# Altium schematic sheet Sheet2.SchDoc
size A3
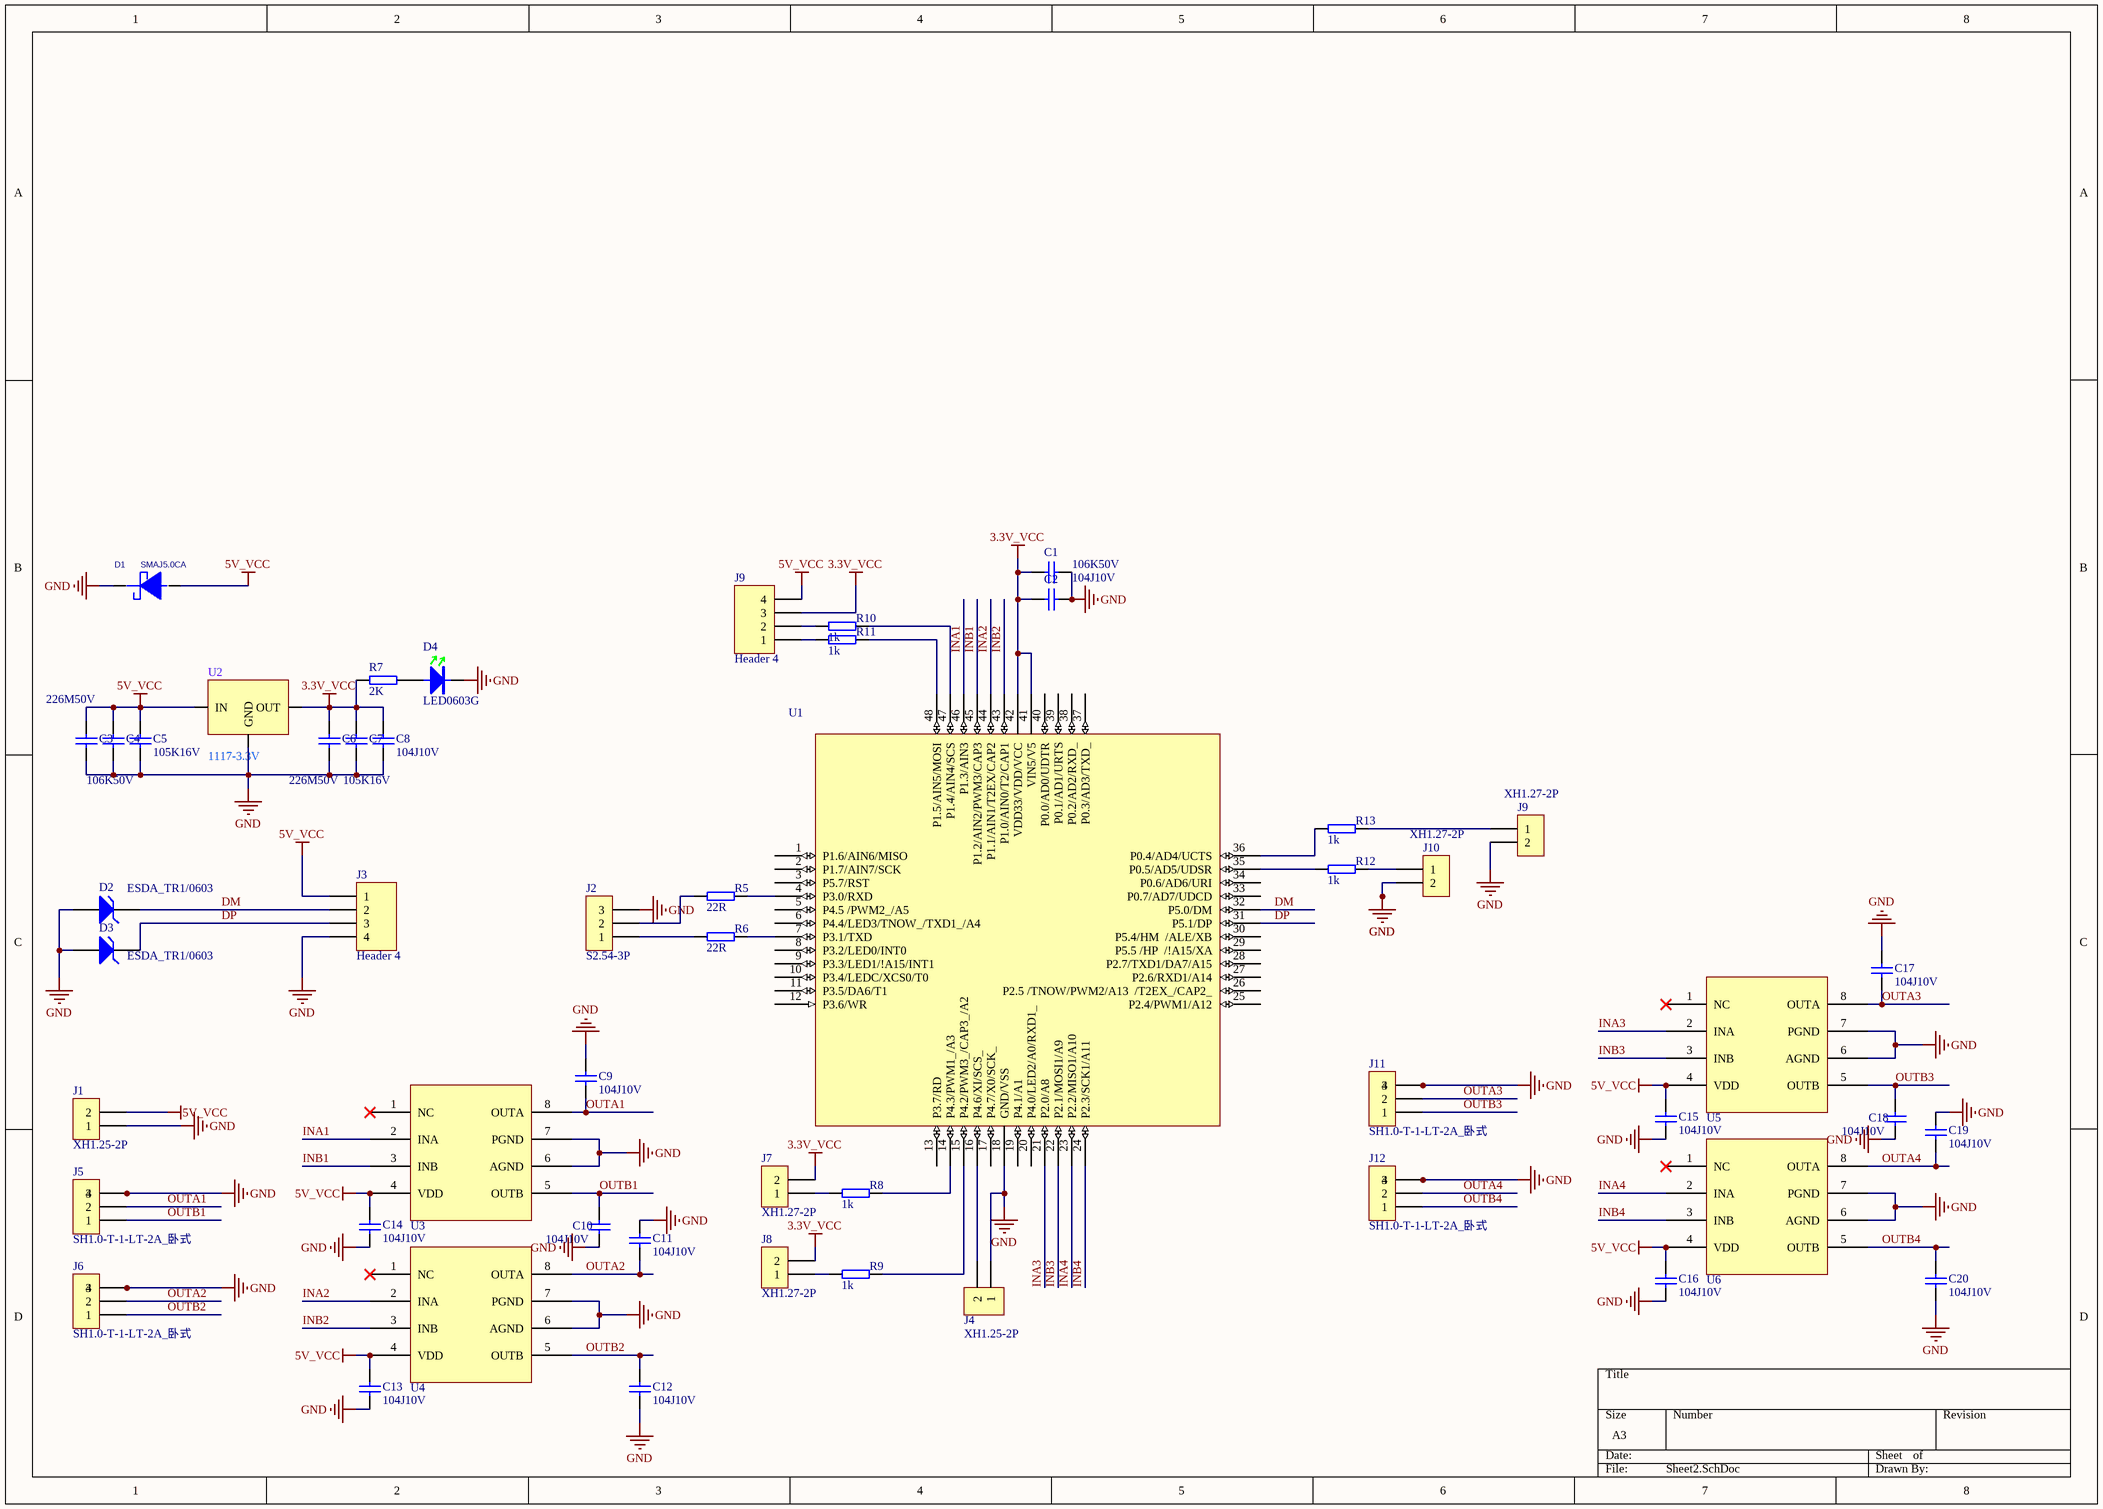
[diagram p0: Sheet2.SchDoc]

## Parts
(Parts that share a designator on the sheet are numbered #1, #2 ... from top to bottom, then left to right.)
C1  106K50V  [C0603]
C2  104J10V  [C0402]
C3  226M50V  [C0805]
C4  106K50V  [C0603]
C5  105K16V  [C0603]
C6  226M50V  [C0805]
C7  105K16V  [C0603]
C8  104J10V  [C0402]
C9  104J10V  [C0402]
C10  104J10V  [C0402]
C11  104J10V  [C0402]
C12  104J10V  [C0402]
C13  104J10V  [C0402]
C14  104J10V  [C0402]
C15  104J10V  [C0402]
C16  104J10V  [C0402]
C17  104J10V  [C0402]
C18  104J10V  [C0402]
C19  104J10V  [C0402]
C20  104J10V  [C0402]
D1  SMAJ5.0CA  [DO-214]
D2  ESDA_TR1/0603  [HS_0603D]
D3  ESDA_TR1/0603  [HS_0603D]
D4  LED0603G  [D-LED0603G]
J1  XH1.25-2P  [XH2.54-2p]
J2  S2.54-3P  [S2.54-3P]
J3  Header 4  [XH2.54-4P]
J4  XH1.25-2P  [S1.25-2P]
J5  SH1.0-T-1-LT-2A_卧式  [J-SH2.0-T-1-LT-2A_立式]
J6  SH1.0-T-1-LT-2A_卧式  [J-SH2.0-T-1-LT-2A_立式]
J7  XH1.27-2P  [J-SH1.27-2]
J8  XH1.27-2P  [J-SH1.27-2]
J9#1  Header 4  [J-SH1.27 -4]
J9#2  XH1.27-2P  [J-SH1.27-2]
J10  XH1.27-2P  [J-SH1.27-2]
J11  SH1.0-T-1-LT-2A_卧式  [J-SH2.0-T-1-LT-2A_立式]
J12  SH1.0-T-1-LT-2A_卧式  [J-SH2.0-T-1-LT-2A_立式]
R5  22R  [R0603]
R6  22R  [R0603]
R7  2K  [R0603]
R8  1k  [R0603]
R9  1k  [R0603]
R10  1k  [R0603]
R11  1k  [R0603]
R12  1k  [R0603]
R13  1k  [R0603]
U1  CH559L  [LQFP48]  (value not drawn)
U2  1117-3.3V  [SOT-223]
U3  PTC918  [SO-8]  (value not drawn)
U4  PTC918  [SO-8]  (value not drawn)
U5  PTC918  [SO-8]  (value not drawn)
U6  PTC918  [SO-8]  (value not drawn)

## Nets
3.3V_VCC: C1.2 C2.2 C6.1 C7.2 C8.1 J7.2 J8.2 J9#1.3 R7.2 U1.41(VIN5/V5) U1.42(VDD33/VDD/VCC) U2.2(OUT)
5V_VCC: C3.1 C4.1 C5.1 C13.1 C14.1 C15.1 C16.1 D1.1(+) J1.2 J3.1 J9#1.4 U2.3(IN) U3.4(VDD) U4.4(VDD) U5.4(VDD) U6.4(VDD)
GND: C1.1 C2.1 C3.2 C4.2 C5.2 C6.2 C7.1 C8.2 C9.1 C10.2 C11.1 C12.2 C13.2 C14.2 C15.2 C16.2 C17.1 C18.2 C19.1 C20.2 D1.2(-) D2.1(A) D3.1(A) D4.2 J1.1 J2.3 J3.4 J4.1 J5.3 J5.4 J6.3 J6.4 J9#2.2 J10.2 J11.3 J11.4 J12.3 J12.4 U1.18(GND/VSS) U2.1(GND) U3.6(AGND) U3.7(PGND) U4.6(AGND) U4.7(PGND) U5.6(AGND) U5.7(PGND) U6.6(AGND) U6.7(PGND)
DM: D2.2(K) J3.2 U1.32(P5.0/DM)
DP: D3.2(K) J3.3 U1.31(P5.1/DP)
INA1: U1.46(P1.3/AIN3) U3.2(INA)
INA2: U1.44(P1.1/AIN1/T2EX/CAP2) U4.2(INA)
INA3: U1.21(P2.0/A8) U5.2(INA)
INA4: U1.23(P2.2/MISO1/A10) U6.2(INA)
INB1: U1.45(P1.2/AIN2/PWM3/CAP3) U3.3(INB)
INB2: U1.43(P1.0/AIN0/T2/CAP1) U4.3(INB)
INB3: U1.22(P2.1/MOSI1/A9) U5.3(INB)
INB4: U1.24(P2.3/SCK1/A11) U6.3(INB)
OUTA1: C9.2 J5.2 U3.8(OUTA)
OUTA2: C11.2 J6.2 U4.8(OUTA)
OUTA3: C17.2 J11.2 U5.8(OUTA)
OUTA4: C19.2 J12.2 U6.8(OUTA)
OUTB1: C10.1 J5.1 U3.5(OUTB)
OUTB2: C12.1 J6.1 U4.5(OUTB)
OUTB3: C18.1 J11.1 U5.5(OUTB)
OUTB4: C20.1 J12.1 U6.5(OUTB)
NetD4_1: D4.1 R7.1
NetJ2_1: J2.1 R6.1
NetJ2_2: J2.2 R5.1
NetJ4_2: J4.2 U1.16(P4.6/XI/SCS_)
NetJ7_1: J7.1 R8.1
NetJ8_1: J8.1 R9.1
NetJ9#1_1: J9#1.1 R11.1
NetJ9#1_2: J9#1.2 R10.1
NetJ9#2_1: J9#2.1 R13.2
NetJ10_1: J10.1 R12.2
NetR5_2: R5.2 U1.4(P3.0/RXD)
NetR6_2: R6.2 U1.7(P3.1/TXD)
NetR8_2: R8.2 U1.14(P4.3/PWM1_/A3)
NetR9_2: R9.2 U1.15(P4.2/PWM3_/CAP3_/A2)
NetR10_2: R10.2 U1.47(P1.4/AIN4/SCS)
NetR11_2: R11.2 U1.48(P1.5/AIN5/MOSI)
NetR12_1: R12.1 U1.35(P0.5/AD5/UDSR)
NetR13_1: R13.1 U1.36(P0.4/AD4/UCTS)

Not connected (* = marked no-connect by the designer): U1 1(P1.6/AIN6/MISO) 2(P1.7/AIN7/SCK) 3(P5.7/RST) 5(P4.5_/PWM2_/A5) 6(P4.4/LED3/TNOW_/TXD1_/A4) 8(P3.2/LED0/INT0) 9(P3.3/LED1/!A15/INT1) 10(P3.4/LEDC/XCS0/T0) 11(P3.5/DA6/T1) 12(P3.6/WR) 13(P3.7/RD) 17(P4.7/X0/SCK_) 19(P4.1/A1) 20(P4.0/LED2/A0/RXD1_) 25(P2.4/PWM1/A12) 26(P2.5_/TNOW/PWM2/A13__/T2EX_/CAP2_) 27(P2.6/RXD1/A14) 28(P2.7/TXD1/DA7/A15) 29(P5.5_/HP__/!A15/XA) 30(P5.4/HM__/ALE/XB) 33(P0.7/AD7/UDCD) 34(P0.6/AD6/URI) 37(P0.3/AD3/TXD_) 38(P0.2/AD2/RXD_) 39(P0.1/AD1/URTS) 40(P0.0/AD0/UDTR); U3 1(NC)*; U4 1(NC)*; U5 1(NC)*; U6 1(NC)*

## Library data of the parts
C1 C4 = C0603X7R-106K50V: 贴片电容-陶瓷; 规格型号: 10uF±10%_50V_X7R_C0603; 生产商: 风华 三星; 供应商: *; 备注: *
C2 C8-C20 = C0402X7R-104J10V: 贴片电容-陶瓷; 规格型号: 100nF±5%_10V_X7R_C0402; 生产商: 风华 三星; 供应商: *; 备注: *
C3 C6 = C0805Y5V-226M50V: 贴片电容-陶瓷; 规格型号: 22uF±20%_50V_Y5V_C0805; 生产商: 风华 三星; 供应商: *; 备注: *
C5 C7 = C0603X7R-105K16V: 贴片电容-陶瓷; 规格型号: 1uF±10%_16V_X7R_C0603; 生产商: 风华 三星; 供应商: *; 备注: *
D2 D3 = D Zener: Zener Diode; Published: *; LatestRevisionDate: *; LatestRevisionNote: *; PackageReference: *; Publisher: *
D4 = DLED-0603-G: 贴片二极管-LED; 规格型号: 0603-GREEN; 货品编码: 无样品无编码; 生产商: *; 供应商: *; 备注: *
J1 = J-XH2.54-2P_1: 接插件-2.54; 货品编码: 371007; 供应商: *; 规格型号: XH2.54-2P; 备注: *
J2 = J-S2.54-3P: 单排排针-直针; 货品编码: 372015; 供应商: *; 规格型号: S2.54-3P; 备注: *
J3 J9#1 = Header 4: Header, 4-Pin; LatestRevisionDate: 17-Jul-2002; LatestRevisionNote: Re-released for DXP Platform.; Publisher: Altium Limited
J4 = J-XH2.54-2P: 接插件-2.54; 货品编码: 371007; 供应商: *; 规格型号: XH2.54-2P; 备注: *
J7 J8 J9#2 J10 = J-XH1.27-2P: 接插件-1.27; 规格型号: XH2.54-2P; 货品编码: 371007; 供应商: *; 备注: *
R5-R13 = R0603-100RF: 贴片电阻-通用; 生产商: 厚声 国巨; 规格型号: 100R±1%_1/10W_±200ppm_R0603; 备注: *; 供应商: *
U1 = CH559L: 单片机
U2 = AP1117-33 SOT-223: 芯片 电源类; 单价: 0.15
U3-U6 = PTC918: 马达驱动芯片
D1 = SMAJ5.0CA: PCB DECAL: DO-214; Value: SMAJ5.0CA